# EAGLE schematic RCSfullschematic1 (EAGLE 7.5.0)
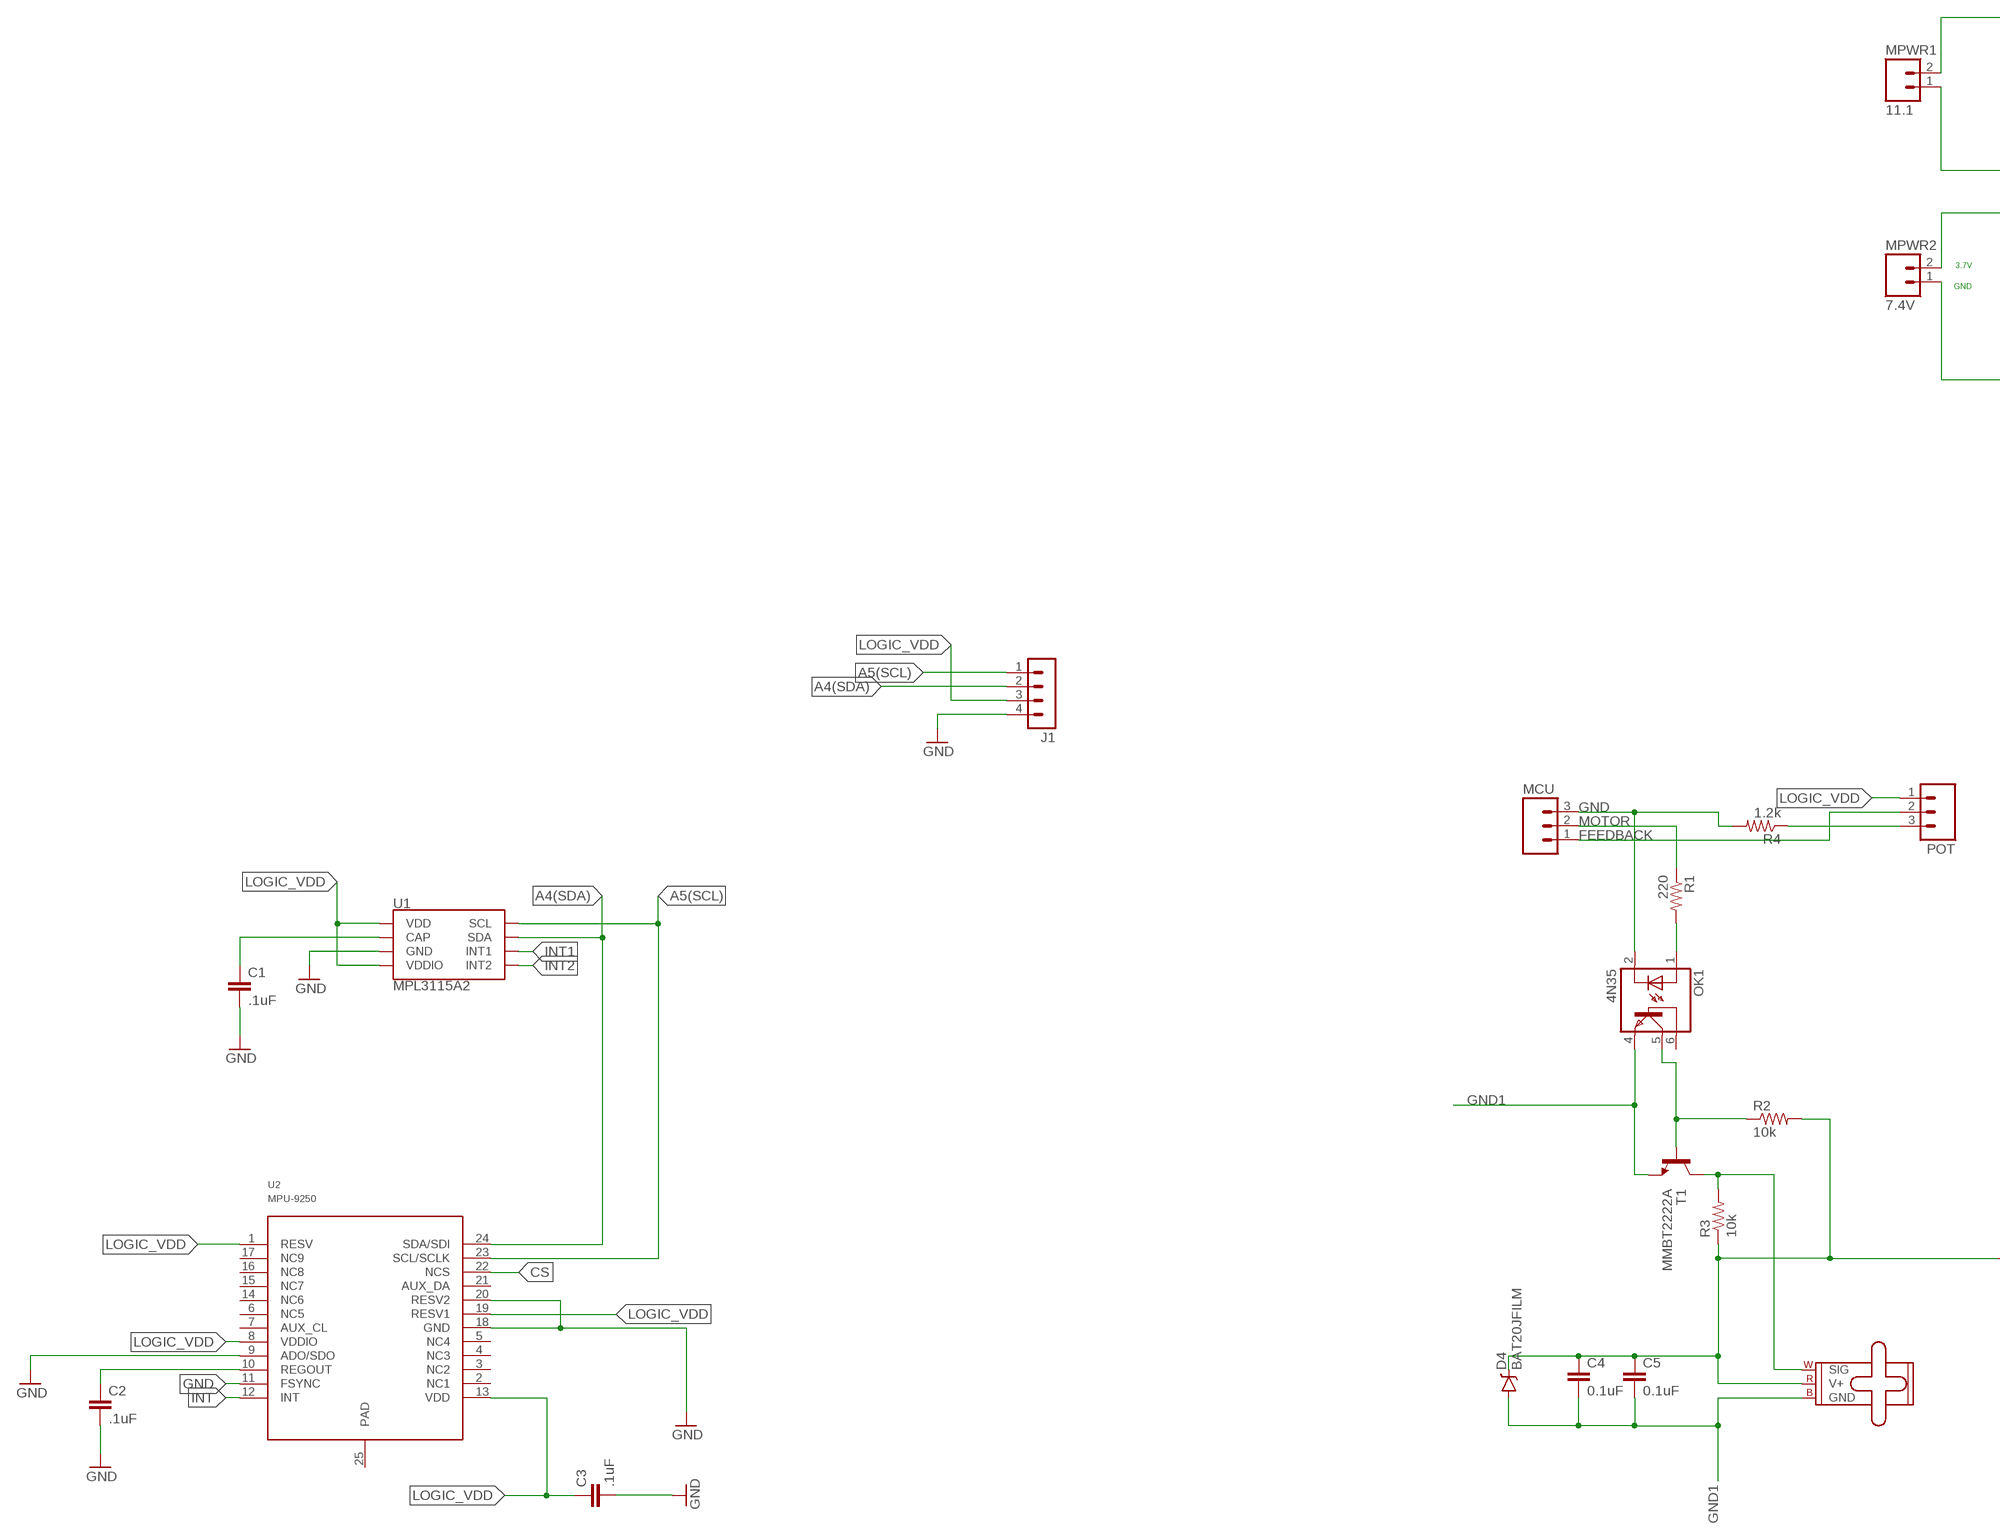
[diagram p0: schematic, sheet 1, part 1 of 2]
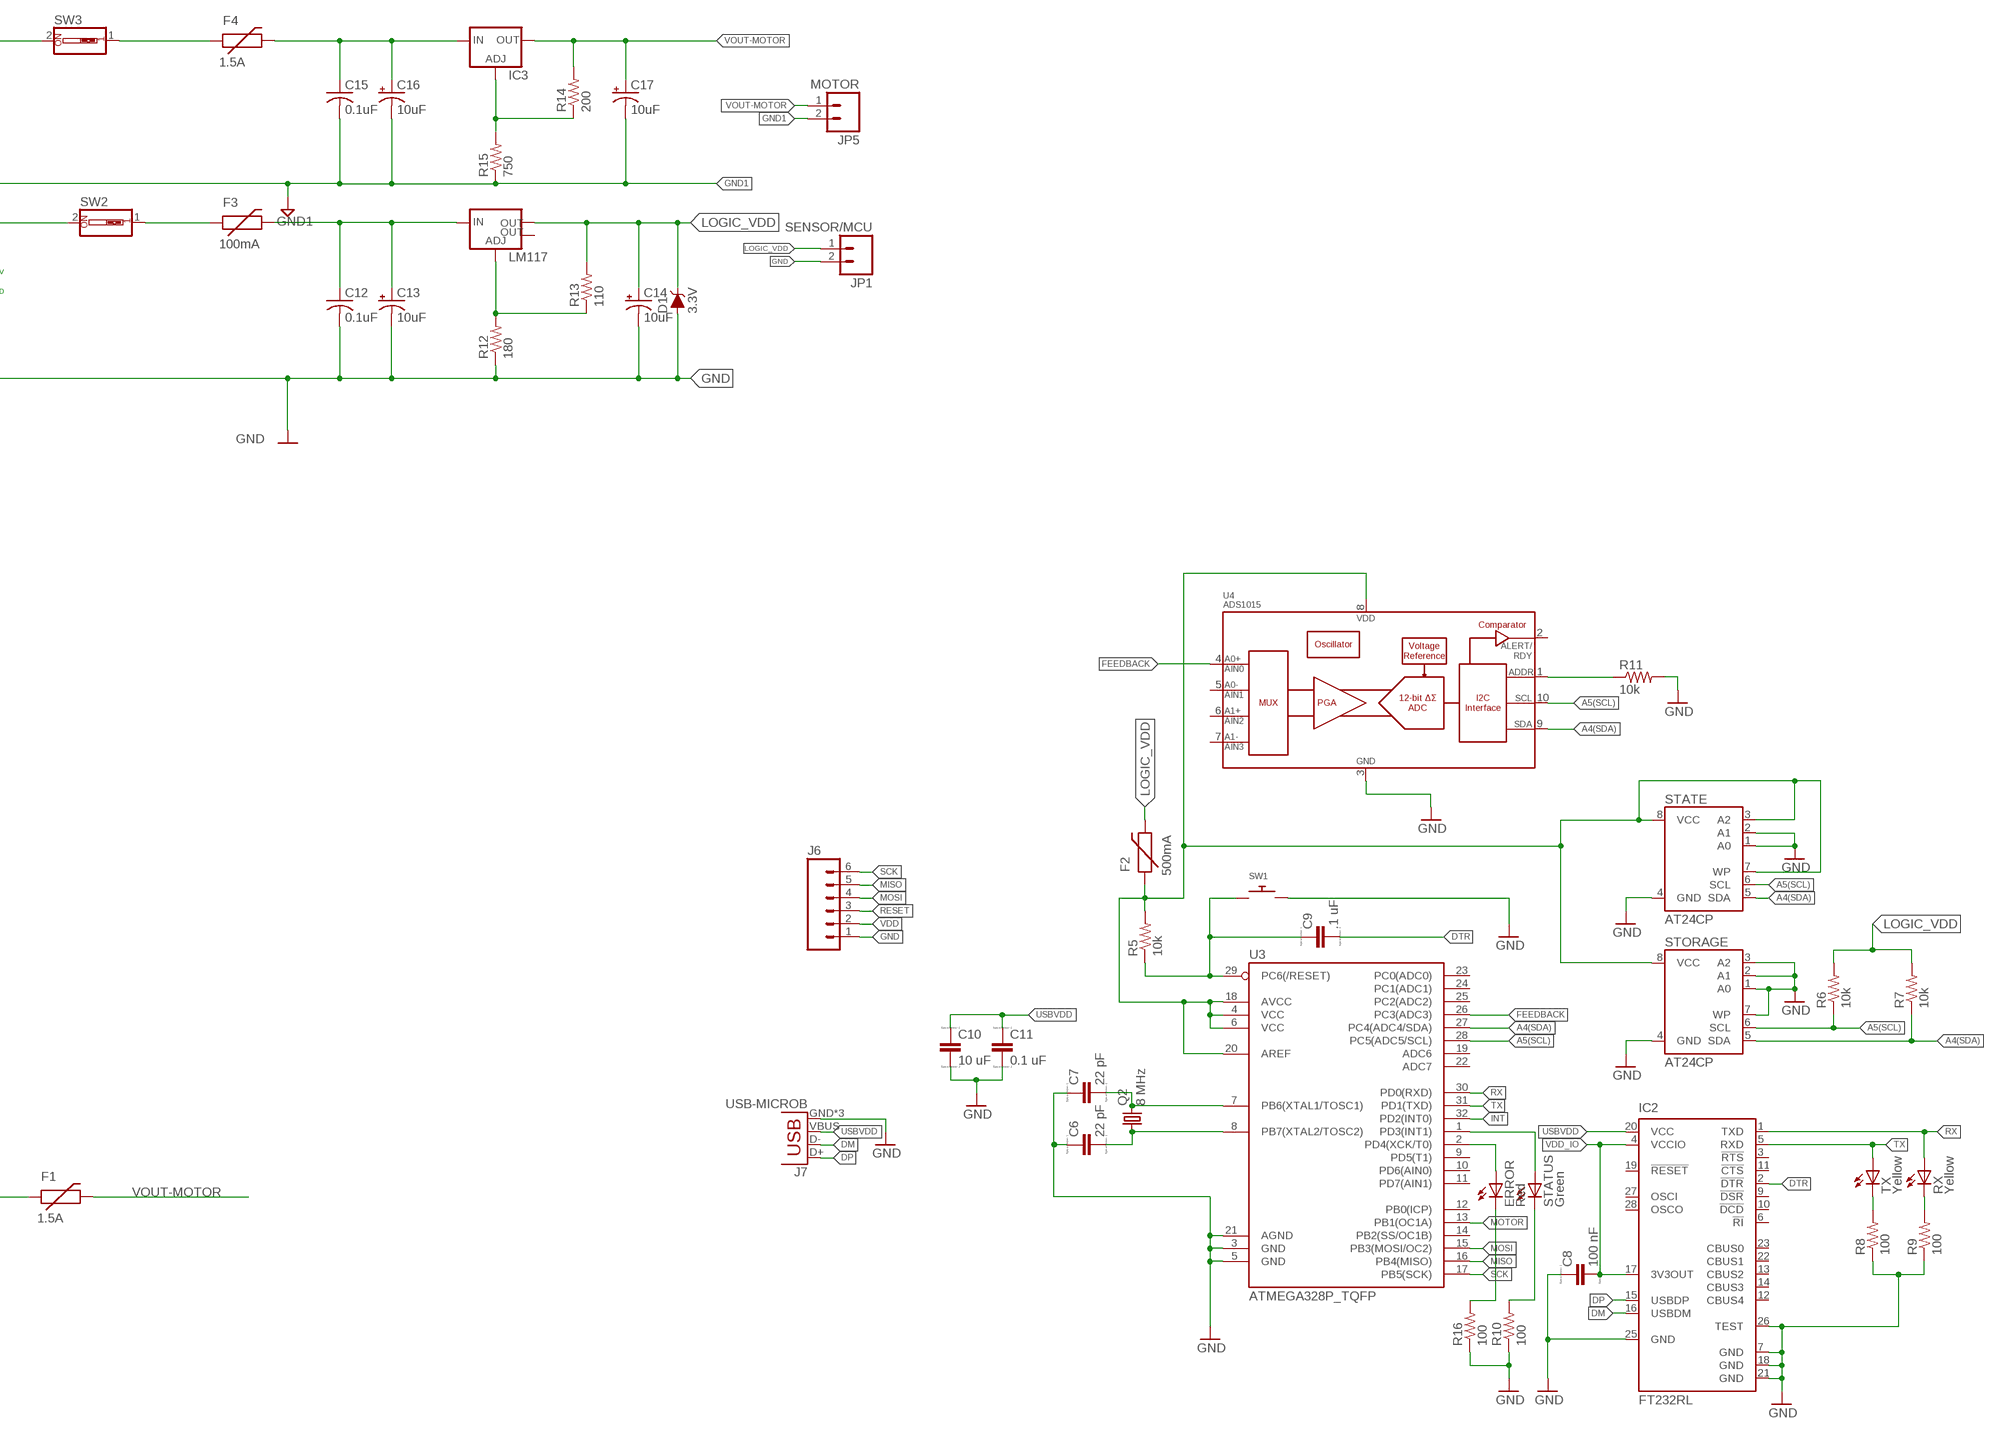
[diagram p1: schematic, sheet 1, part 2 of 2]

## Parts
C1  .1uF  10UF-1206-6.3V-20%  [1206]
C2  .1uF  10UF-1206-6.3V-20%  [1206]
C3  .1uF  10UF-1206-6.3V-20%  [1206]
C4  0.1uF  CAP1206  [1206]
C5  0.1uF  CAP1206  [1206]
C6  22 pF  CC1206  [C1206]
C7  22 pF  CC1206  [C1206]
C8  100 nF  CC1206  [C1206]
C9  .1 uF  CC1206  [C1206]
C10  10 uF  CC1206  [C1206]
C11  0.1 uF  CC1206  [C1206]
C12  0.1uF  C-USC1206  [C1206]
C13  10uF  10UF-POLAR-EIA3216-16V-10%(TANT)  [EIA3216]
C14  10uF  10UF-POLAR-EIA3216-16V-10%(TANT)  [EIA3216]
C15  0.1uF  C-USC1206  [C1206]
C16  10uF  10UF-POLAR-EIA3216-16V-10%(TANT)  [EIA3216]
C17  10uF  10UF-POLAR-EIA3216-16V-10%(TANT)  [EIA3216]
D1  3.3V  DIODE-ZENER-BZT52C3V6S  [SOD-323@2]
D4  BAT20JFILM  [SOD-323]
ERROR  Red  LEDCHIPLED_1206  [CHIPLED_1206]
F1  1.5A  PTCSMD  [PTC-1206]
F2  500mA  PTCSMD  [PTC-1206]
F3  100mA  PTCSMD  [PTC-1206]
F4  1.5A  PTCSMD  [PTC-1206]
IC2  FT232RL  [SSOP28]
IC3  LM317TS  [317TS]
J1  MA04-1  [MA04-1]
J6  M06LOCK  [1X06_LOCK]
J7  USB-MICROB  [USB-MICROB]
JP1  SENSOR/MCU  M02PTH  [1X02]
JP5  MOTOR  M02PTH  [1X02]
LM117  V_REG_LM1117SOT223  [SOT223]
MCU  M03PTH  [1X03]
MPWR1  11.1  M02PTH  [1X02]
MPWR2  7.4V  M02PTH  [1X02]
OK1  4N35  [DIL06]
POT  M03PTH  [1X03]
Q2  8 MHz  CRYSTALHC49S  [HC49/S]
R1  220  RESISTOR1206  [1206]
R2  10k  RESISTOR1206  [1206]
R3  10k  RESISTOR1206  [1206]
R4  1.2k  RESISTOR1206  [1206]
R5  10k  R-US_R1206  [R1206]
R6  10k  R-US_R1206  [R1206]
R7  10k  R-US_R1206  [R1206]
R8  100  R-US_R1206  [R1206]
R9  100  R-US_R1206  [R1206]
R10  100  R-US_R1206  [R1206]
R11  10k  R-US_R1206  [R1206]
R12  180  R-US_M1206  [M1206]
R13  110  R-US_M1206  [M1206]
R14  200  R-US_M1206  [M1206]
R15  750  R-US_M1206  [M1206]
R16  100  R-US_R1206  [R1206]
RX  Yellow  LEDCHIPLED_1206  [CHIPLED_1206]
SERVO  SMALL_SERVO  [1X03]
STATE  AT24CP  [DIL08]
STATUS  Green  LEDCHIPLED_1206  [CHIPLED_1206]
STORAGE  AT24CP  [DIL08]
SW1  SWITCH_PUSHBUTTONSOFTTOUCHSMD_SJ  [PUSHBUTTON_SMD_SJ]
SW2  SW_DIP-1  [EDG-01]
SW3  SW_DIP-1  [EDG-01]
T1  MMBT2222A  TRANSISTOR_NPNMMBT2222A  [SOT23-3]
TX  Yellow  LEDCHIPLED_1206  [CHIPLED_1206]
U1  MPL3115A2  [LGA-8]
U2  MPU-9250  [LEAD-QFN24]
U3  ATMEGA328P_TQFP  [TQFP32-08]
U4  ADS1015  [MSOP10]

## Nets
6V_POWER [Motor]: C4.1 C5.1 D4.C F1.1 R2.2 R3.1 SERVO.2(V+)
A4(SDA): J1.2 R7.1 STATE.5(SDA) STORAGE.5(SDA) U1.7(SDA) U2.24(SDA/SDI) U3.27(PC4(ADC4/SDA)) U4.9(SDA)
A5(SCL): J1.1 R6.1 STATE.6(SCL) STORAGE.6(SCL) U1.8(SCL) U2.23(SCL/SCLK) U3.28(PC5(ADC5/SCL)) U4.10(SCL)
CS: U2.22(NCS)
DM: IC2.16(USBDM) J7.D-
DP: IC2.15(USBDP) J7.D+
DTR: C9.2 IC2.2(!DTR)
FEEDBACK: MCU.1 POT.2 U3.26(PC3(ADC3)) U4.4(AIN0)
GND: C1.2 C2.2 C3.2 C6.1 C7.1 C8.1 C10.2 C11.2 C12.2 C13.- C14.- D1.A IC2.7(GND) IC2.18(GND) IC2.21(GND) IC2.25(GND) IC2.26(TEST) J1.4 J6.1 J7.GND J7.MT1(GND) J7.MT2(GND) JP1.2 MCU.3 MPWR2.1 OK1.2(C) R4.2 R8.1 R9.1 R10.1 R11.2 R12.1 R16.1 STATE.1(A0) STATE.2(A1) STATE.4(GND) STORAGE.1(A0) STORAGE.2(A1) STORAGE.3(A2) STORAGE.4(GND) STORAGE.7(WP) SW1.P$2 U1.3(GND) U2.9(ADO/SDO) U2.11(FSYNC) U2.18(GND) U2.20(RESV2) U3.3(GND) U3.5(GND) U3.21(AGND) U4.3(VSS)
GND1 [Motor]: C4.2 C5.2 C15.2 C16.- C17.- D4.A JP5.2 MPWR1.1 OK1.4(EMI) R15.1 SERVO.3(GND) T1.2(E)
INT: U2.12(INT) U3.32(PD2(INT0))
INT1: U1.6(INT1)
INT2: U1.5(INT2)
LOGIC_VDD: C3.1 C14.+ D1.C F2.2 J1.3 JP1.1 LM117.2(OUT) POT.1 R6.2 R7.2 R13.2 U1.1(VDD) U1.4(VDDIO) U2.1(RESV) U2.8(VDDIO) U2.13(VDD) U2.19(RESV1)
MISO: J6.5 U3.16(PB4(MISO))
MOSI: J6.4 U3.15(PB3(MOSI/OC2))
MOTOR: MCU.2 R1.1 U3.13(PB1(OC1A))
N$1: C1.1 U1.2(CAP)
N$2 [Motor]: OK1.5(COL) R2.1 T1.1(B)
N$3: C2.1 U2.10(REGOUT)
N$5: POT.3 R4.1
N$6: R11.1 U4.1(ADDR)
N$7: OK1.1(A) R1.2
N$8: C7.2 Q2.2 U3.7(PB6(XTAL1/TOSC1))
N$9: C6.2 Q2.1 U3.8(PB7(XTAL2/TOSC2))
N$10: R8.2 TX.C
N$11: R9.2 RX.C
N$12: STATUS.A U3.1(PD3(INT1))
N$13: R10.2 STATUS.C
N$14: ERROR.C R16.2
N$15: LM117.1(ADJ) R12.2 R13.1
N$16: MPWR2.2 SW2.2
N$17: C12.1 C13.+ F3.2 LM117.3(IN)
N$18: F3.1 SW2.1
N$19 [Motor]: MPWR1.2 SW3.2
N$20 [Motor]: F4.1 SW3.1
N$21 [Motor]: C15.1 C16.+ F4.2 IC3.3(IN)
N$22 [Motor]: IC3.1(ADJ) R14.1 R15.2
N$23: ERROR.A U3.2(PD4(XCK/T0))
RESET: C9.1 J6.3 R5.1 SW1.P$1 U3.29(PC6(/RESET))
RX: IC2.1(TXD) RX.A U3.30(PD0(RXD))
SCK: J6.6 U3.17(PB5(SCK))
SIGNAL [Motor]: R3.2 SERVO.1(SIG) T1.3(C)
TX: IC2.5(RXD) TX.A U3.31(PD1(TXD))
USBVDD: C10.1 C11.1 IC2.20(VCC) J7.VBUS
VCC: F2.1 R5.2 STATE.3(A2) STATE.7(WP) STATE.8(VCC) STORAGE.8(VCC) U3.4(VCC) U3.6(VCC) U3.18(AVCC) U3.20(AREF) U4.8(VDD)
VDD: J6.2
VDD_IO: C8.2 IC2.4(VCCIO) IC2.17(3V3OUT)
VOUT-MOTOR [Motor]: C17.+ F1.2 IC3.2(OUT) JP5.1 R14.2
Unconnected: IC2.3(!RTS) IC2.6(!RI) IC2.9(!DSR) IC2.10(!DCD) IC2.11(!CTS) IC2.12(CBUS4) IC2.13(CBUS2) IC2.14(CBUS3) IC2.19(!RESET) IC2.22(CBUS1) IC2.23(CBUS0) IC2.27(OSCI) IC2.28(OSCO) LM117.4(OUT) OK1.6(BAS) U2.2(NC1) U2.3(NC2) U2.4(NC3) U2.5(NC4) U2.6(NC5) U2.7(AUX_CL) U2.14(NC6) U2.15(NC7) U2.16(NC8) U2.17(NC9) U2.21(AUX_DA) U2.25(PAD) U3.9(PD5(T1)) U3.10(PD6(AIN0)) U3.11(PD7(AIN1)) U3.12(PB0(ICP)) U3.14(PB2(SS/OC1B)) U3.19(ADC6) U3.22(ADC7) U3.23(PC0(ADC0)) U3.24(PC1(ADC1)) U3.25(PC2(ADC2)) U4.2(ALERT/RDY) U4.5(AIN1) U4.6(AIN2) U4.7(AIN3)

## Notes on the sheet
- 3.7V
- GND

## Library data of the parts
C1-C3 = SparkFun-Capacitors:10UF: 10.0µF ceramic capacitors A capacitor is a passive two-terminal electrical component used to store electrical energy temporarily in an electric field.; PROD_ID: CAP-10057; VALUE: 10uF
C4 C5 = SparkFun-Passives:CAP: Capacitor Standard 0603 ceramic capacitor, and 0.1" leaded capacitor.
C6-C11 = eagle-ltspice:C: CAPACITOR, European symbol; SPICEMODEL: NONE; SPICEPREFIX: C
C12 C15 = rcl:C-US: CAPACITOR, American symbol
C13 C14 C16 C17 = SparkFun-Capacitors:10UF-POLAR: 10.0µF polarized capacitors A capacitor is a passive two-terminal electrical component used to store electrical energy temporarily in an electric field.; PROD_ID: CAP-00811
D1 = SparkFun-DiscreteSemi:DIODE-ZENER: Zener Diode A Zener diode allows current to flow from its anode to its cathode like a normal semiconductor diode, but it also permits current to flow in the reverse direction when its "Zener voltage" is reached. - WIkipedia; PROD_ID: DIO-08199; VALUE: 3.6V
D4 = SparkFun-DiscreteSemi:BAT20JFILM: 23V, 1A Schottky diode, SOD-323 package; PROD_ID: DIO-11623
ERROR RX STATUS TX = adafruit:LED: LED OSRAM: - CHIPLED LG R971, LG N971, LY N971, LG Q971, LY Q971, LO R971, LY R971 LH N974, LH R974 LS Q976, LO Q976, LY Q976 LO Q996 - Hyper CHIPLED LW Q18S LB Q993, LB Q99A, LB R99A - SideLED LS A670, LO A670, LY A670, LG A670, LP A670 LB A673, LV A673, LT A673, LW A673 LH A674 LY A675 LS A676, LA A676, LO A676, LY A676, LW A676 LS A679, LY A679, LG A679 - Hyper Micro SIDELED® LS Y876, LA Y876, LO Y876, LY Y876 LT Y87S - SmartLED LW L88C, LW L88S LB L89C, LB L89S, LG L890 LS L89K, LO L89K, LY L89K LS L896, LA L896, LO L896, LY L896 - TOPLED LS T670, LO T670, LY T670, LG T670, LP T670 LSG T670, LSP T670, LSY T670, LOP T670, LYG T670 LG T671, LOG T671, LSG T671 LB T673, LV T673, LT T673, LW T673 LH T674 LS T676, LA T676, LO T676, LY T676, LB T676, LH T676, LSB T676, LW T676 LB T67C, LV T67C, LT T67C, LS T67K, LO T67K, LY T67K, LW E67C LS E67B, LA E67B, LO E67B, LY E67B, LB E67C, LV E67C, LT E67C LW T67C LS T679, LY T679, LG T679 LS T770, LO T770, LY T770, LG T770, LP T770 LB T773, LV T773, LT T773, LW T773 LH T774 LS E675, LA E675, LY E675, LS T675 LS T776, LA T776, LO T776, LY T776, LB T776 LHGB T686 LT T68C, LB T68C - Hyper Mini TOPLED® LB M676 - Mini TOPLED Santana® LG M470 LS M47K, LO M47K, LY M47K Source: http://www.osram.convergy.de/
F1-F4 = SparkFun-PowerIC:PTC: Resettable Fuse PTC Resettable Fuse. Spark Fun Electronics SKU : COM-08357; PROD_ID: RES-11150
IC2 = ftdichip:FT232R: Source: http://www.ftdichip.com/Documents/DataSheets/DS_FT232R_v104.pdf; MPN: FT232RL; OC_FARNELL: 1146032; OC_NEWARK: 91K9918
IC3 = v-reg:LM317TS: VOLTAGE REGULATOR
J1 = con-lstb:MA04-1: PIN HEADER; OC_FARNELL: unknown; OC_NEWARK: unknown
J6 = SparkFun-Connectors:M06: Header 6 Standard 6-pin 0.1" header. Use with straight break away headers (SKU : PRT-00116), right angle break away headers (PRT-00553), swiss pins (PRT-00743), machine pins (PRT-00117), and female headers (PRT-00115). Molex polarized connector foot print use with SKU : PRT-08094 with associated crimp pins and housings. NOTES ON THE VARIANTS LOCK and LOCK_LONGPADS... This footprint was designed to help hold the alignment of a through-hole component (i.e. 6-pin header) while soldering it into place. You may notice that each hole has been shifted either up or down by 0.005 of an inch from it's more standard position (which is a perfectly straight line). This slight alteration caused the pins (the squares in the middle) to touch the edges of the holes. Because they are alternating, it causes a "brace" to hold the component in place. 0.005 has proven to be the perfect amount of "off-center" position when using our standard breakaway headers. Although looks a little odd when you look at the bare footprint, once you have a header in there, the alteration is very hard to notice. Also,if you push a header all the way into place, it is covered up entirely on the bottom side. This idea of altering the position of holes to aid alignment will be further integrated into the Sparkfun Library for other footprints. It can help hold any component with 3 or more connection pins.
J7 = SparkFun-Connectors:USB: USB Connectors USB-B-PTH is fully proven SKU : PRT-00139/CONN-08278 USB-miniB is fully proven SKU : PRT-00587 USB-A-PCB is untested. USB-A-H is throughly reviewed, but untested. Spark Fun Electronics SKU : PRT-00437 USB-B-SMT is throughly reviewed, but untested. Needs silkscreen touching up. USB-A-S has not been used/tested USB-MB-H has not been used/tested USB-MICROB has been used. CONN-09505; PROD_ID: CONN-09505
JP1 JP5 MPWR1 MPWR2 = SparkFun-Connectors:M02: Standard 2-pin 0.1" header. Use with - straight break away headers ( PRT-00116) - right angle break away headers (PRT-00553) - swiss pins (PRT-00743) - machine pins (PRT-00117) - female headers (PRT-00115) Molex polarized connector foot print use with: PRT-08233 with associated crimp pins and housings. 2.54_SCREWTERM for use with PRT-10571. 3.5mm Screw Terminal footprints for PRT-08084 5mm Screw Terminal footprints for use with PRT-08432
LM117 = SparkFun-IC-Power:V_REG_LM1117: Voltage Regulator LM1117 Standard adjustable voltage regulator but in SMD form. Spark Fun Electronics SKU : COM-00595; PROD_ID: VREG-08170
MCU POT = SparkFun-Connectors:M03: Header 3 Standard 3-pin 0.1" header. Use with straight break away headers (SKU : PRT-00116), right angle break away headers (PRT-00553), swiss pins (PRT-00743), machine pins (PRT-00117), and female headers (PRT-00115). Molex polarized connector foot print use with SKU : PRT-08232 with associated crimp pins and housings.
OK1 = optocoupler:4N35: MOTOROLA OPTO COUPLER; MF: FAIRCHILD SEMICONDUCTOR; MPN: 4N35; OC_FARNELL: 1328375; OC_NEWARK: 72K9946
Q2 = adafruit:CRYSTAL: CRYSTAL; OC_FARNELL: 1667008; OC_NEWARK: unknown
R1-R4 = SparkFun-Passives:RESISTOR: Resistor Basic schematic elements and footprints for 0603, 1206, and PTH resistors.
R5-R11 R16 = adafruit:R-US_: RESISTOR, American symbol
R12-R15 = rcl:R-US_: RESISTOR, American symbol
SERVO = SparkFun-Electromechanical:SMALL_SERVO: Small servo motor This is the small servo used in the SIK. SKU: ROB-09065
STATE STORAGE = atmel:AT24C*: 2-wire serial EEPROM; MPN: AT24C1024BW-SH-B; OC_FARNELL: 1362646; OC_NEWARK: 03P2044
SW1 = adafruit:SWITCH_PUSHBUTTON: Buttons SOFTTOUCHSMD_SJ - Soft touch temporary push button (Super Junk Akihabara) Compatible with SKPMANE010 [Mouser: 688-SKPMAN] C&K_KSS = Digikey: KSS221GLFS
SW2 SW3 = special:SW_DIP-1: DIP SWITCH
T1 = SparkFun-DiscreteSemi:TRANSISTOR_NPN: Generic NPN BJT MMBT2222A - TRANS-08049 (SOT-23, 1A 40V) MPSA42 - TRANS-09116 (SOT-23, 500mA 300V) MMBT5088LT1G - TRANS-11160 (SOT-23, 50 mA 30V) BC547 - COM-08928 <http://www.sparkfun.com/products/8928> (TO-92 45V 100mA) (1.Collector 2.Base 3.Emitter) 2N3904 - COM-00521 <http://www.sparkfun.com/products/521> (TO-92 40V 200mA) (1.Emitter 2.Base 3.Collector) P2N2222A - COM-12852 <http://www.sparkfun.com/products/12852> (TO-92 40V 600mA) (1.Collector 2.Base 3.Emitter); PROD_ID: TRANS-08049
U1 = SparkFun-Sensors:MPL3115A2: NXP MPL3115A2 Digital Altimeter/Pressure Sensor The MPL3115A2 is a compact piezoresistive absolute pressure sensor with an I2C interface. MPL3115 has a wide operating range of 20kPa to 110 kPa, a range that covers all surface elevations on Earth. The fully internally compensated MEMS in conjunction with an embedded high resolution 24-bit equivalent ADC provide accurate pressure [Pascals] /altitude [meters] and temperature [degrees Celsius] data. Datasheet <http://cdn.sparkfun.com/datasheets/Sensors/Pressure/MPL3115A2.pdf> SparkFun Products SparkFun Altitude/Pressure Sensor Breakout - MPL3115A2 <https://www.sparkfun.com/products/11084> (SEN-11084) SparkFun Weather Shield <https://www.sparkfun.com/products/12081> (DEV-12081) SparkFun Photon Weather Shield <https://www.sparkfun.com/products/13630> (DEV-13630); PROD_ID: IC-10869
U2 = invensense copy:MPU-9250
U3 = SparkFun-DigitalIC:ATMEGA328P_TQFP; PROD_ID: IC-09069
U4 = SparkFun-AnalogIC:ADS1015: 12-Bit Del-Sig ADC Four single-ended inputs or two differential inputs Internal PGA I2C interface 2.0-5.5V; PROD_ID: IC-12239

## Net classes
1 Motor: width 0.699 mm